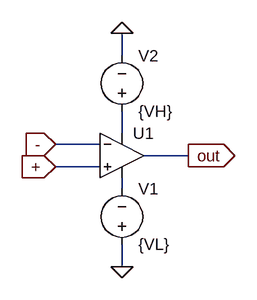
[diagram p0: schematic OpampG.asc]
OpampG.asc, the LTspice schematic file:
Version 4
SHEET 1 880 680
WIRE 192 -80 192 -112
WIRE 192 32 192 0
WIRE 160 48 96 48
WIRE 288 64 224 64
WIRE 160 80 96 80
WIRE 192 112 192 96
WIRE 192 224 192 192
FLAG 192 224 0
FLAG 192 -112 0
FLAG 288 64 out
IOPIN 288 64 Out
FLAG 96 48 -
IOPIN 96 48 In
FLAG 96 80 +
IOPIN 96 80 In
SYMBOL voltage 192 208 M180
WINDOW 0 24 96 Left 2
WINDOW 3 24 16 Left 2
SYMATTR InstName V1
SYMATTR Value {VL}
SYMBOL voltage 192 16 M180
WINDOW 0 24 96 Left 2
WINDOW 3 24 16 Left 2
SYMATTR InstName V2
SYMATTR Value {VH}
SYMBOL Opamps\\UniversalOpamp2 192 64 R0
SYMATTR InstName U1

The netlist it stands for:
* OpampG.asc
V1 0 N002 {VL}
V2 N001 0 {VH}
XU1 + - N001 N002 out level.2 Avol=1Meg GBW=10Meg Slew=10Meg ilimit=25m rail=0 Vos=0 phimargin=45 en=0 enk=0 in=0 ink=0 Rin=500Meg  ; pins IN+ IN- V+ V- OUT
.lib UniversalOpamps2.sub
.backanno
.end